# EAGLE design placasensores (EAGLE 6.6.0)
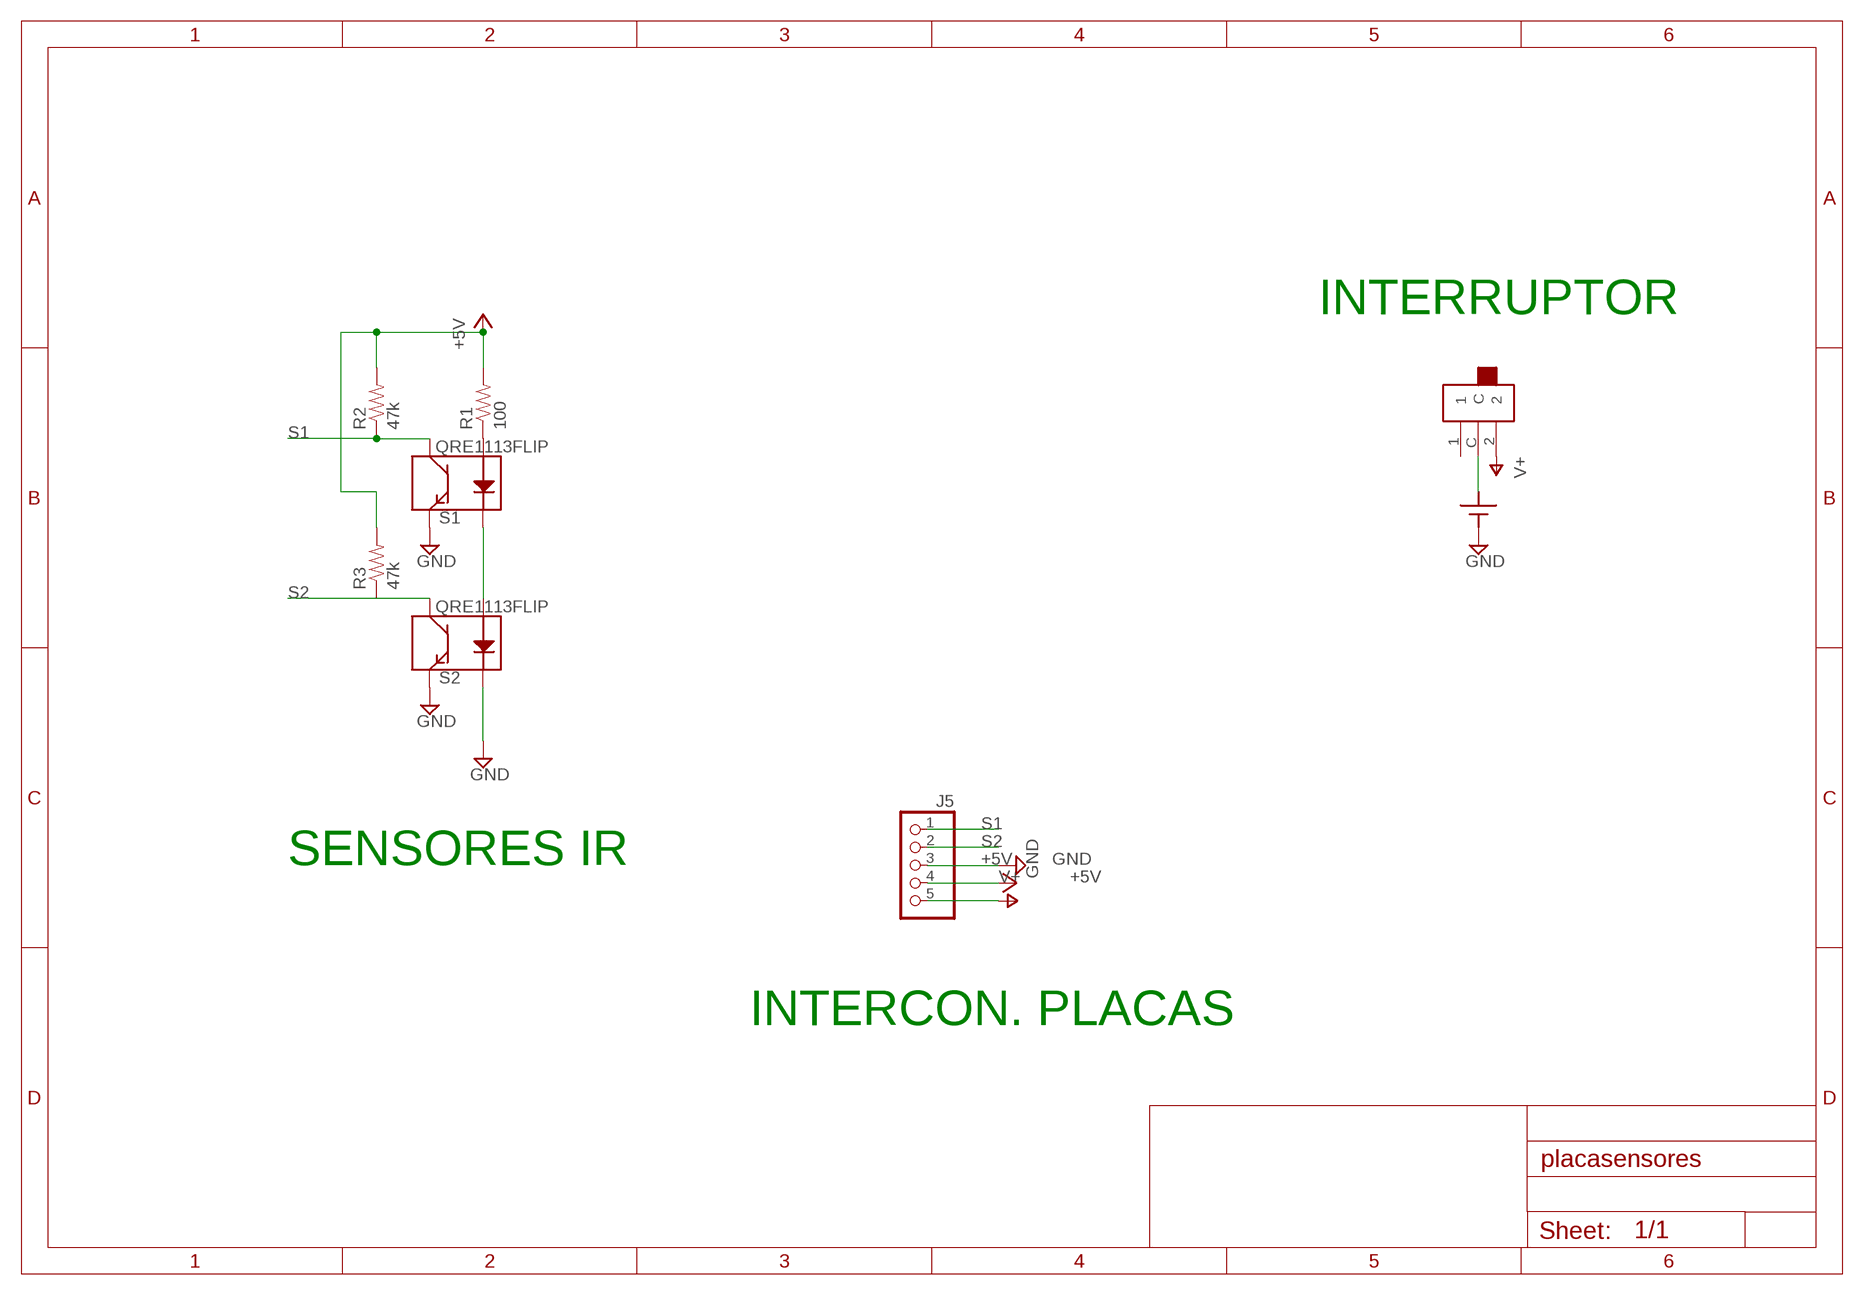
[diagram p0: schematic, sheet 1]

## Parts
J5  PINHD-1X5  [1X05]
R1  100  RESISTOR1206  [1206]
R2  47k  RESISTOR1206  [1206]
R3  47k  RESISTOR1206  [1206]
S1  QRE1113FLIP  [QRE1113GR_HOLE]
S2  QRE1113FLIP  [QRE1113GR_HOLE]
SW1  SK-12D07G3  [SK-12D07G3]
U$3  5XAA  [5XAAHOLDER]

## Nets
+5V: J5.4 R1.2 R2.2 R3.2
GND: J5.3 S1.E S2.E S2.K U$3.P$2
N$1: S1.K S2.A
N$2: R1.1 S1.A
N$11: SW1.C U$3.P$1
S1: J5.1 R2.1 S1.C
S2: J5.2 R3.1 S2.C
V+: J5.5 SW1.2
Unconnected: SW1.1

## Notes on the sheet
- INTERRUPTOR
- SENSORES IR
- INTERCON. PLACAS

## Library data of the parts
J5 = pinhead:PINHD-1X5: PIN HEADER
R1-R3 = SparkFun-Passives:RESISTOR: Resistor Basic schematic elements and footprints for 0603, 1206, and PTH resistors.
S1 S2 = Sumobot:QRE1113
SW1 = Sumobot:SK-12D07G3
U$3 = Sumobot:5XAA

## Board
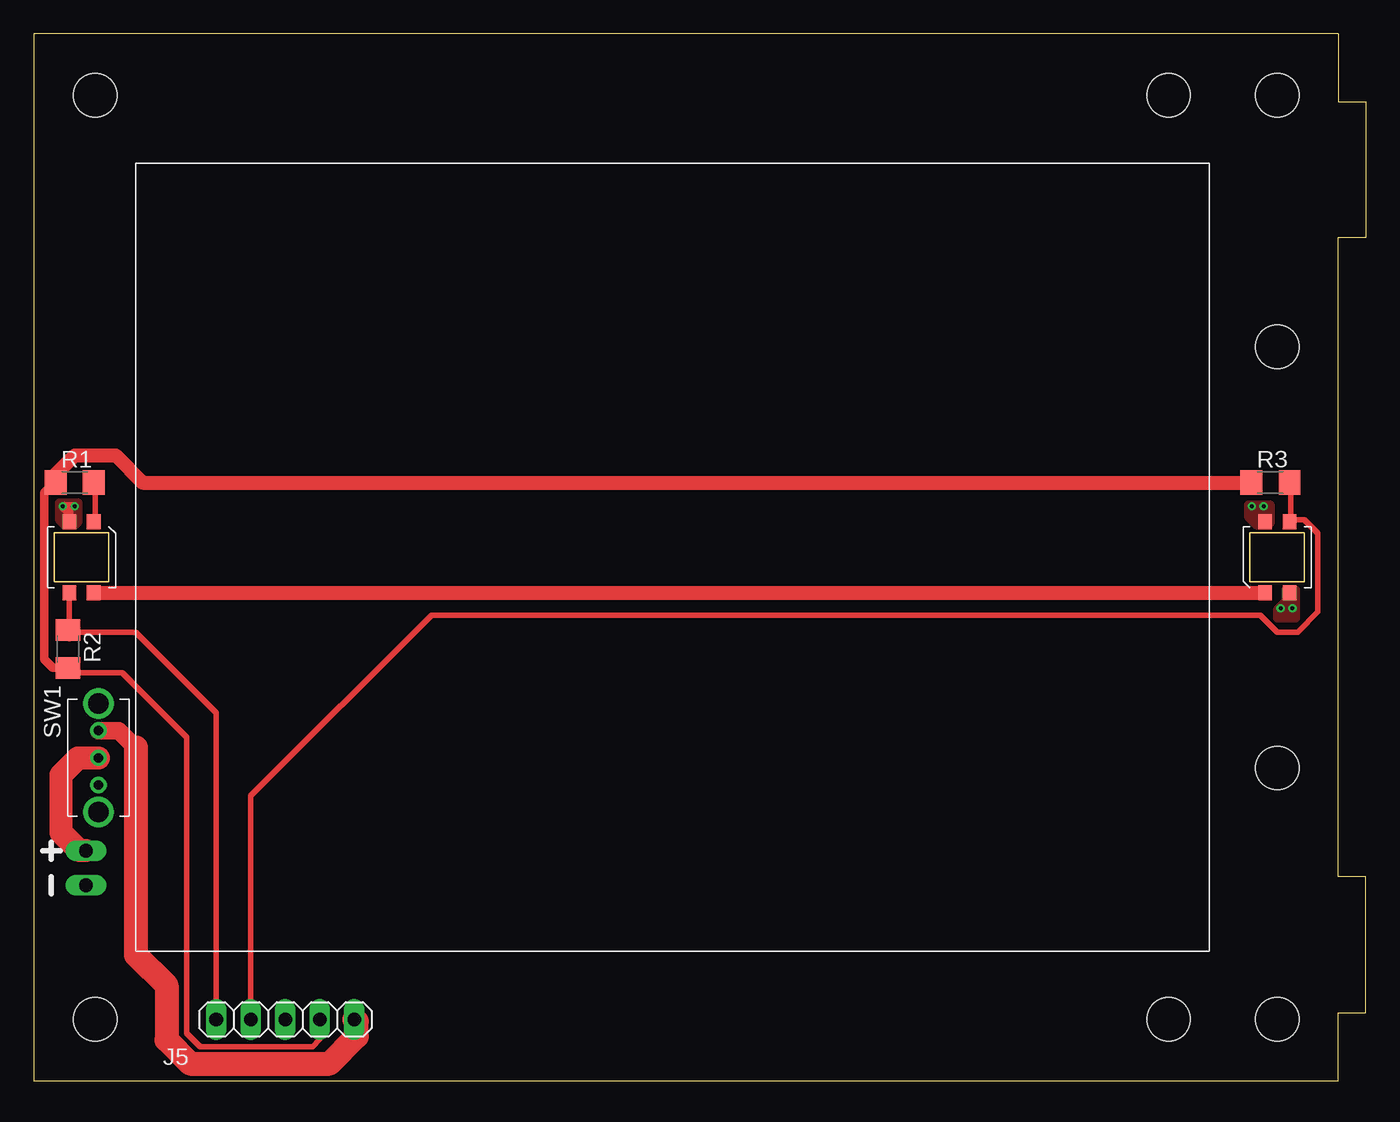
[diagram p1: board, top side]
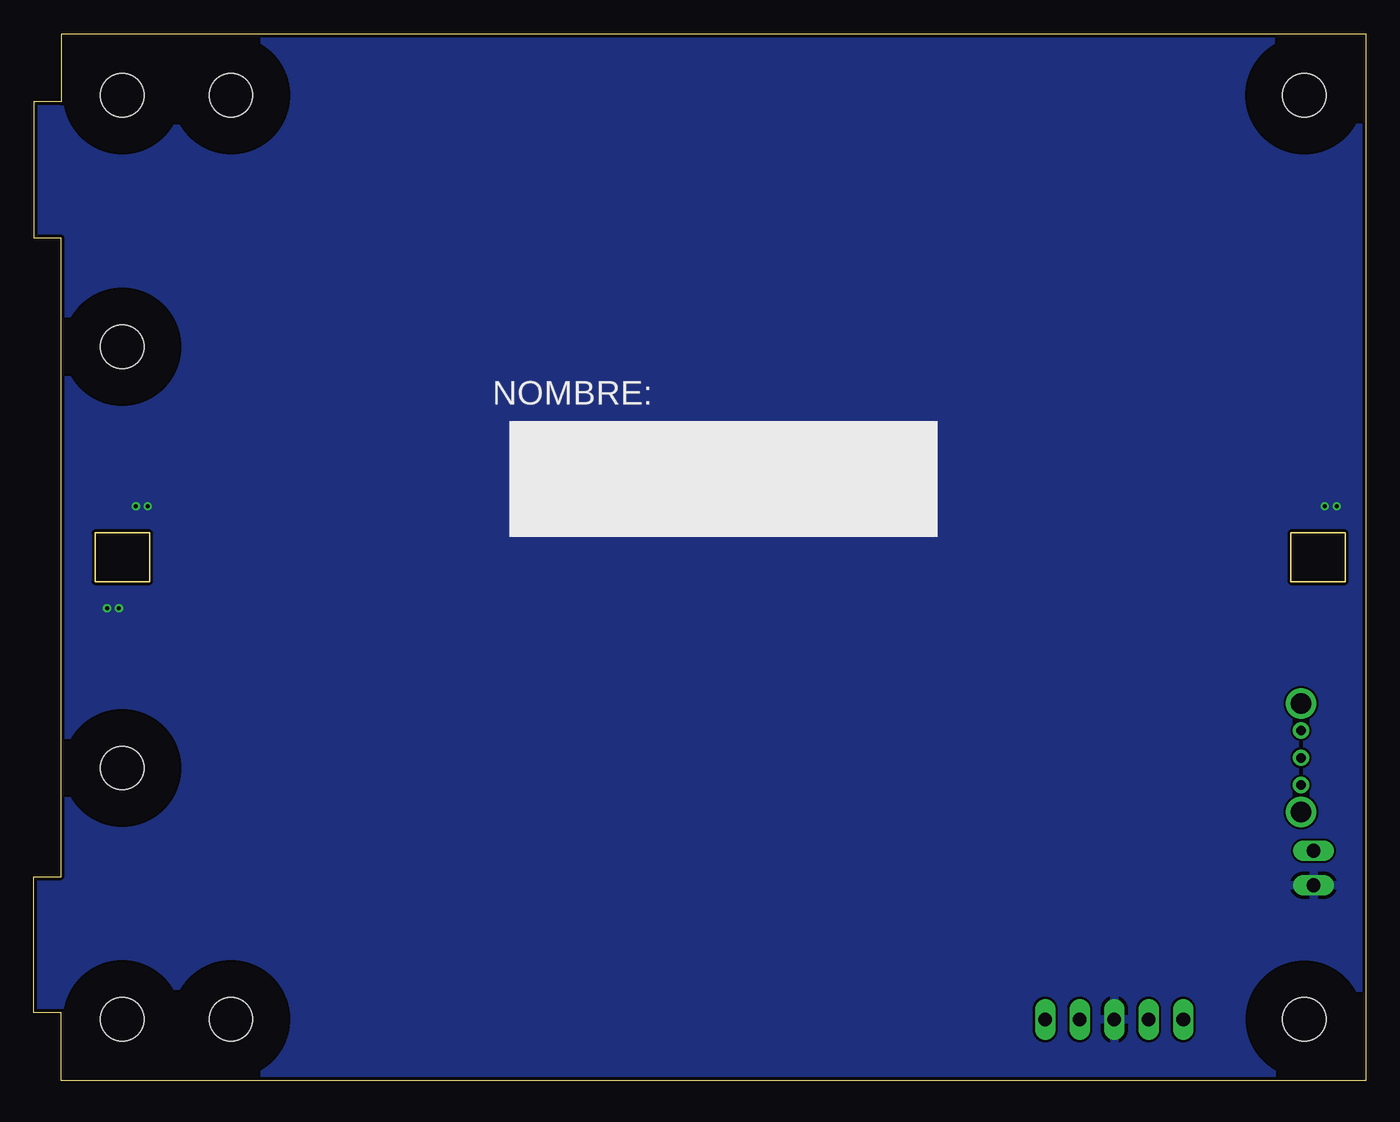
[diagram p2: board, bottom side, seen from below]

Size 98 x 77 mm. Coordinates in mm from the lower left corner, seen from the top.
Outline: 0,0 88,0 96,0 96,5 98,5 98,15 96,15 96,62 98,62 98,72 96,72 96,77 88,77 0,77 0,0
Copper layers (1*16): Top 0.035mm / dielectric 1.5mm / Bottom 0.035mm
Design rules "Fusion_eagle_rule_v1.1": minimum track width 6mil, minimum drill 0.3mm, track to track 6mil, track to pad 6mil, pad to pad 6mil, via to via 6mil, smd to smd 0mil, copper to edge 10mil, drill to drill 10mil, minimum pad ring 10mil, minimum via ring 6mil, stop-mask expansion 2mil, vias tented up to drill 100mil, thermal gap 10mil
Holes 3.2 mm at 91.5,72.5 91.5,4.5 91.5,54 91.5,23 4.5,72.5 83.5,72.5 4.5,4.5 83.5,4.5
tRestrict: area 0.5,68.5 to 8.5,76.5; area 0.5,0.5 to 8.5,8.5; area 79.5,68.5 to 87.5,76.5; area 79.5,0.5 to 87.5,8.5
bRestrict: area 87.5,68.5 to 95.5,76.5; area 87.5,50 to 95.5,58; area 87.5,19 to 95.5,27; area 87.5,0.5 to 95.5,8.5; area 0.5,0.5 to 8.5,8.5; area 0.5,68.5 to 8.5,76.5; area 79.5,0.5 to 87.5,8.5; area 79.5,68.5 to 87.5,76.5; area 87.5,68.5 to 95.5,76.5; area 87.5,0.5 to 95.5,8.5

### Footprints (pad centres in the part's own frame; a part is rotated, then mirrored left to right if it is on the bottom)
1X05 = drill 1.016 long: 1 -5.08,0; 2 -2.54,0; 3 0,0; 4 2.54,0; 5 5.08,0
1206 = smd 1.6 x 1.8: 1 -1.4,0; 2 1.4,0
QRE1113GR_HOLE = smd 1.1 x 1: A -2.625,0.9; C 2.625,-0.9; E -2.625,-0.9; K 2.625,0.9
SK-12D07G3 = drill 0.7: 1 -2,0; 2 2,0; C 0,0 | drill 1.5: S1 -4,0; S2 4,0
5XAAHOLDER = drill 1 long: P$1 -43.18,-21.59; P$2 -43.18,-24.13

### Placement (x,y rotation side)
J5  18.5,4.5 0 top
R1  3,44 180 top
R2  2.5,31.75 270 top
R3  91,44 180 top
S1  3.5,38.5 270 top
S2  91.5,38.5 90 top
SW1  4.75,23.75 90 top
U$3  47,38.5 0 top

### Tracks (layer width: path | path; a pad name or v marks a point on that pad's centre or on a via)
+5V
  Top 0.406: J5.4 21.04,3.04 20.5,2.5 12.25,2.5 11.25,3.5 11.25,25.25 6.5,30 2.38,30 2,30.38
  Top 0.61: R1.2 1.9,44.4 0.75,43.25 0.75,31 1.38,30.38 2,30.38 2.48,30.38 R2.2
  Top 1.016: R1.2 1.6,44.6 3,46 6,46 8,44 R3.2
GND  (via drill 0.3)
  Top 0.61: v3,42.25 v2.12,42.25 2.6,41.77 S1.E
  other vias: 90.5,42.25 89.62,42.25 91.75,34.75 92.62,34.75
  pour Bottom: -11.75,76 -13.5,76 -12.88,-6.88 109.75,-6.88 109.75,43.38 107.5,43.38 113,78.38 -5.5,79.62 -12.62,81.25 -12.5,80.5 -11.25,78.62 -11.38,77.88
  pour Top (no thermals): 3.25,42.5 1.88,42.5 1.88,41.25 2.25,40.88 3,40.88 3.25,41.12
  pour Top (no thermals): 89.38,42.38 89.38,41.5 90,40.88 90.88,40.88 91,41 91,42.38
  pour Top (no thermals): 92.12,36.12 92.12,35.25 91.5,34.62 91.5,34 92.88,34 92.88,36.12
N$1
  Top 1.016: S1.K S2.A
N$2
  Top 0.406: 4.5,40.98 4.5,43.9 R1.1
  Top 0.61: 4.5,40.98 S1.A
N$11
  Top 1.676: U$3.P$1 3.34,16.91 2,18.25 2,22.5 3.25,23.75 SW1.C
S1
  Top 0.406: S1.C 2.6,32.5 R2.1 2.65,33 7.5,33 13.42,27.08 J5.1
S2
  Top 0.406: J5.2 15.96,20.96 29.25,34.25 90.25,34.25 91.5,33 93,33 94.5,34.5 94.5,40.25 93.5,41.25 92.53,41.25 S2.C | 92.5,41.48 92.5,43.9 R3.1
  Top 0.61: 92.5,41.48 S2.C
V+
  Top 1.27: SW1.2 6.25,25.75 7.5,24.5
  Top 1.778: 7.5,24.5 7.5,9.25 9.75,7 9.75,3 11.5,1.25 21.75,1.25 23.75,3.25 23.75,4.33 J5.5

### Text on the board
bPlace: NOMBRE: